# EAGLE schematic dfp_grove (EAGLE 9.6.2)
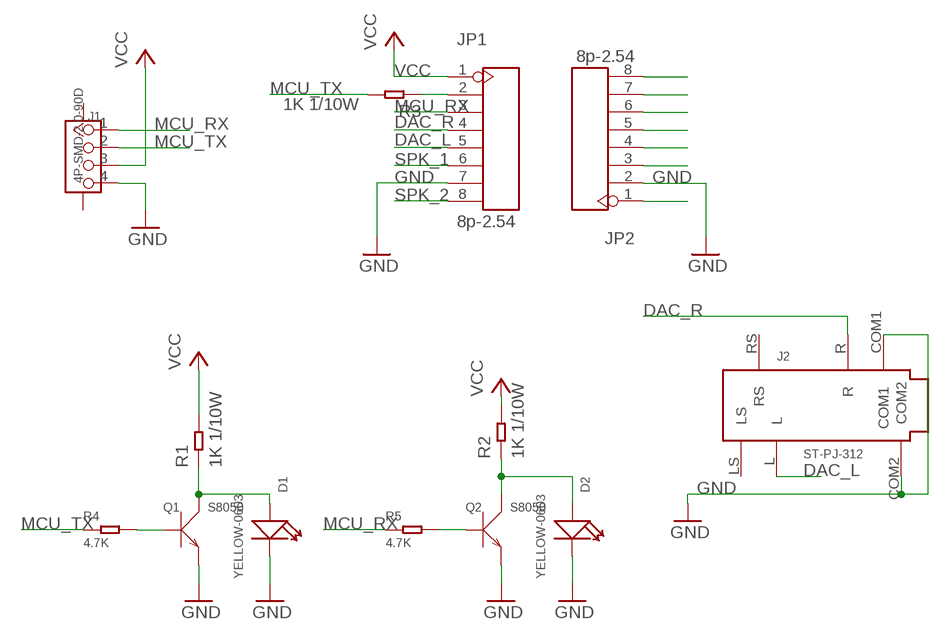
[diagram p0: schematic, sheet 1]

## Parts
D1  YELLOW-0603  SMD-LED-CLEAR-YELLOW(0603)  [LED-0603]
D2  YELLOW-0603  SMD-LED-CLEAR-YELLOW(0603)  [LED-0603]
J1  4P-SMD-2.0-90D  GROVE-CONNECTOR-SMD-90D(4+2P-2.0)  [HW4-SMD-2.0-90D]
J2  ST-PJ-312  AUDIO-JACK-6P-SMD(ST-PJ-312)  [AUDIO6P-SMD-3.5-14.0X6.4X5.0MM]
JP1  8p-2.54  DIP-BLACK-FEMALE-HEADER-VERT(8P-2.54)  [H8-2.54]
JP2  8p-2.54  DIP-BLACK-FEMALE-HEADER-VERT(8P-2.54)  [H8-2.54]
Q1  S8050  SMD-TRANSISTORS-NPN-25V-500MW-S8050(SOT-23)  [SOT-23]
Q2  S8050  SMD-TRANSISTORS-NPN-25V-500MW-S8050(SOT-23)  [SOT-23]
R1  1K 1/10W  SMD-RES-1K-5%-1/10W(0603)  [R0603]
R2  1K 1/10W  SMD-RES-1K-5%-1/10W(0603)  [R0603]
R3  1K 1/10W  SMD-RES-1K-5%-1/10W(0603)  [R0603]
R4  4.7K  SMD-RES-4.7K-5%-1/10W(0603)  [R0603]
R5  4.7K  SMD-RES-4.7K-5%-1/10W(0603)  [R0603]

## Nets
DAC_L: J2.L JP1.5
DAC_R: J2.R JP1.4
GND: D1.- D2.- J1.4 J2.COM1 J2.COM2 JP1.7 JP2.2 Q1.2(E) Q2.2(E)
MCU_RX: J1.1 JP1.3 R5.1
MCU_TX: J1.2 R3.2 R4.1
N$1: D2.+ Q2.3(C) R2.1
N$2: Q2.1(B) R5.2
N$4: Q1.1(B) R4.2
N$5: D1.+ Q1.3(C) R1.1
N$9: JP2.8
N$10: JP2.7
N$11: JP2.6
N$12: JP2.5
N$13: JP2.4
N$14: JP2.3
N$16: JP2.1
RX: JP1.2 R3.1
SPK_1: JP1.6
SPK_2: JP1.8
VCC: J1.3 JP1.1 R1.2 R2.2
Unconnected: J1.SS1 J1.SS2 J2.LS J2.RS

## Library data of the parts
D1 D2 = OPL_Optoelectronics:SMD-LED-CLEAR-YELLOW(0603): 304090044; MPN: 19-217-Y5C-AM1N1VY-3T
J1 = OPL_Connector:GROVE-CONNECTOR-SMD-90D(4+2P-2.0): 320110032
J2 = OPL_Connector:AUDIO-JACK-6P-SMD(ST-PJ-312): 320040007; MPN: ST-PJ-312
JP1 JP2 = OPL_Connector:DIP-BLACK-FEMALE-HEADER-VERT(8P-2.54): 320030061; MPN: F185-1108A1BSYC1
Q1 Q2 = OPL_Discrete_Semiconductor:SMD-TRANSISTORS-NPN-25V-500MW-S8050(SOT-23): 305010017; MPN: S8050
R1-R3 = OPL_Resistor:SMD-RES-1K-5%-1/10W(0603): 301010291; MPN: RC0603JR-071KL
R4 R5 = OPL_Resistor:SMD-RES-4.7K-5%-1/10W(0603): 301010290; MPN: RC0603JR-074K7L